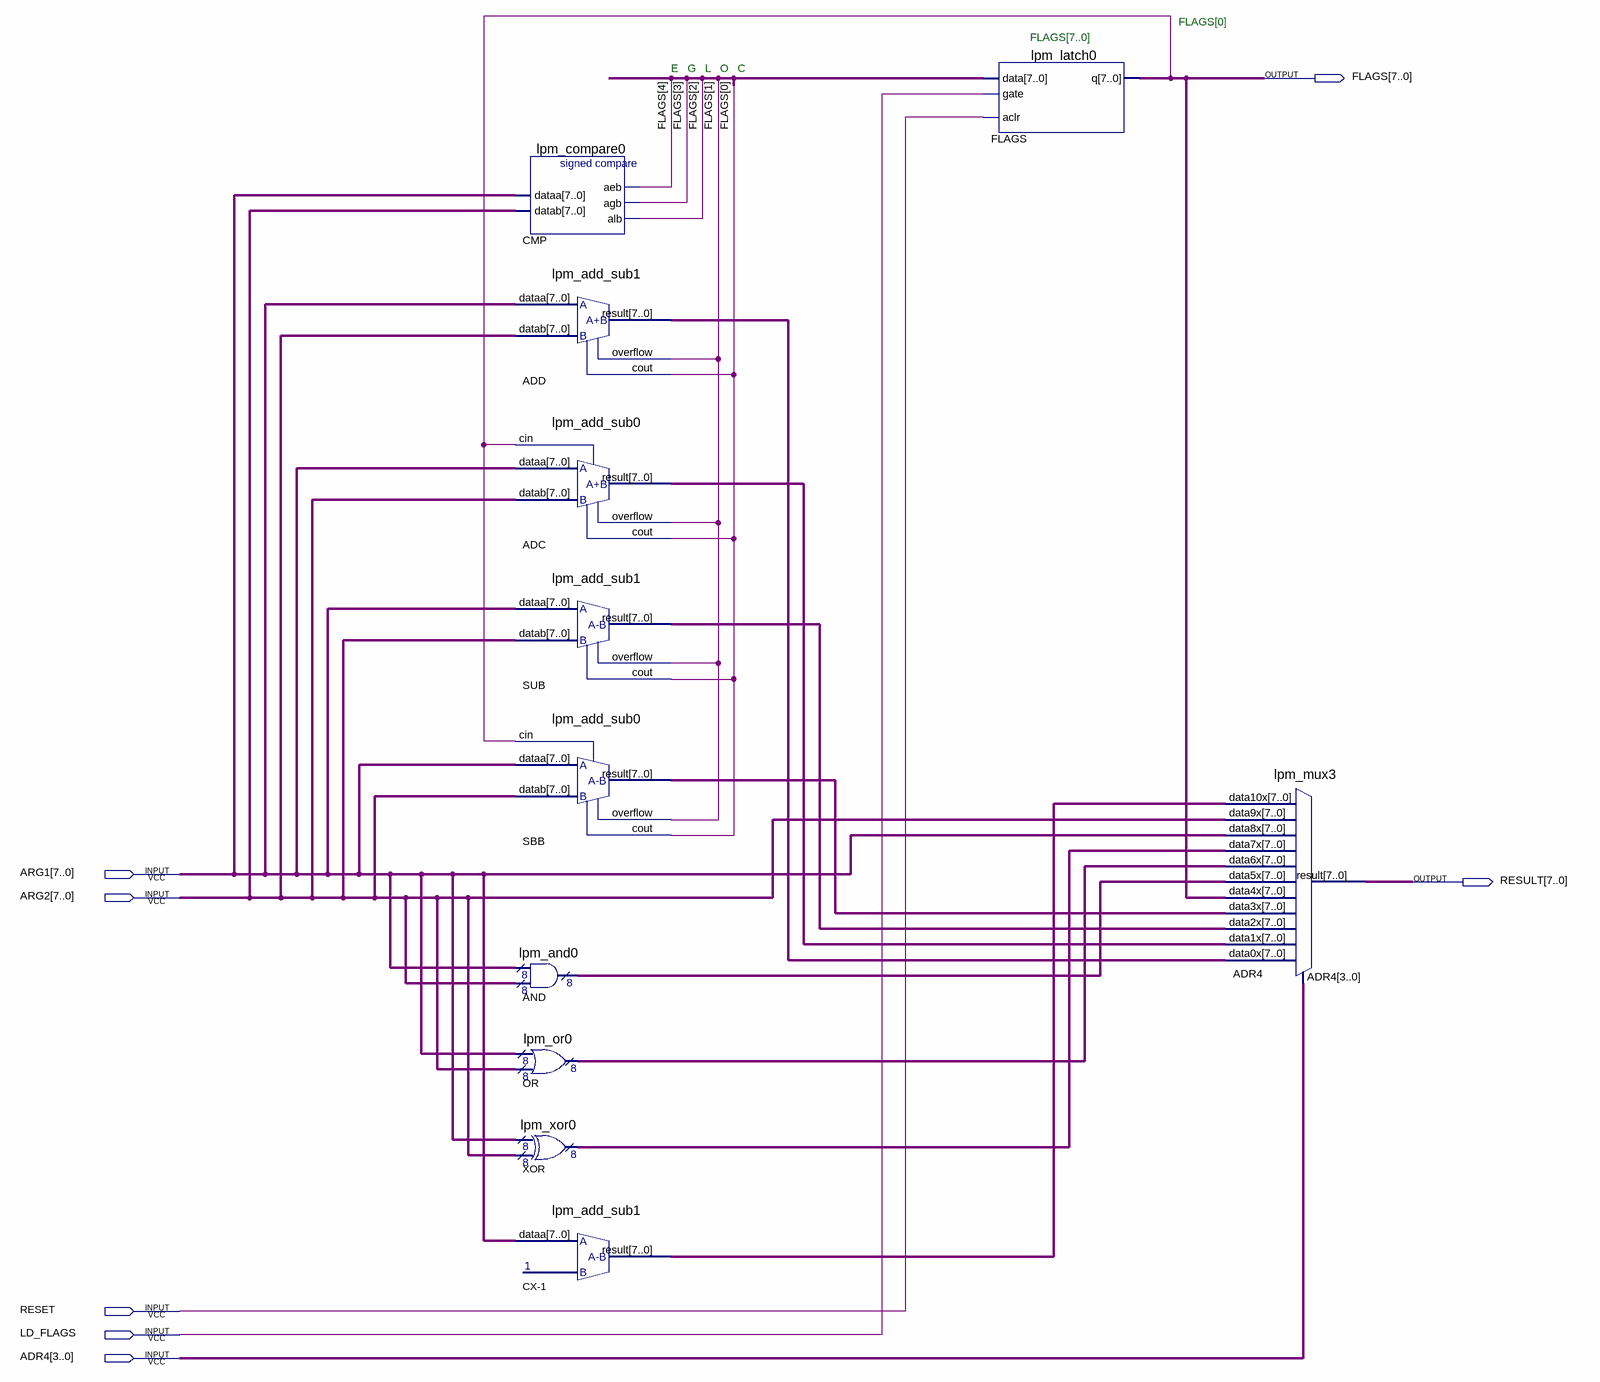
[diagram p0: schematic sheet]
// Quartus schematic ALU.bdf as structural Verilog: 11 symbols, 7 pins
module ALU (
  input  [7:0] ARG1,
  input  [7:0] ARG2,
  input  RESET,
  input  LD_FLAGS,
  input  [3:0] ADR4,
  output [7:0] FLAGS,
  output [7:0] RESULT
);

  wire undriven;
  wire [7:0] ADC_result, ADD_result, AND_result, CX_1_result, OR_result, SBB_result, SUB_result, undriven_2,
       XOR_result;

  lpm_compare0 CMP (.dataa(ARG1), .datab(ARG2), .aeb(FLAGS[4]), .agb(FLAGS[3]), .alb(FLAGS[2]));
  lpm_add_sub1 ADD (.dataa(ARG1), .datab(ARG2), .result(ADD_result), .overflow(FLAGS[1]), .cout(FLAGS[0]));
  lpm_add_sub0 ADC (
    .dataa(ARG1), .datab(ARG2), .cin(undriven), .result(ADC_result), .overflow(FLAGS[1]), .cout(FLAGS[0]));
  lpm_add_sub1 SUB (.dataa(ARG1), .datab(ARG2), .result(SUB_result), .overflow(FLAGS[1]), .cout(FLAGS[0]));
  lpm_add_sub0 SBB (
    .dataa(ARG1), .datab(ARG2), .cin(undriven), .result(SBB_result), .overflow(FLAGS[1]), .cout(FLAGS[0]));
  lpm_and0 AND (.data0x(ARG1), .data1x(ARG2), .result(AND_result));
  lpm_or0 OR (.data0x(ARG1), .data1x(ARG2), .result(OR_result));
  lpm_xor0 XOR (.data0x(ARG1), .data1x(ARG2), .result(XOR_result));
  lpm_add_sub1 \CX-1  (.dataa(ARG1), .result(CX_1_result));
  lpm_latch0 u_FLAGS (.data(undriven_2), .gate(LD_FLAGS), .aclr(RESET), .q(FLAGS));
  lpm_mux3 u_ADR4 (
    .data10x(CX_1_result), .data9x(ARG2), .data8x(ARG1), .data7x(XOR_result), .data6x(OR_result),
    .data5x(AND_result), .data4x(FLAGS), .data3x(SBB_result), .data2x(SUB_result), .data1x(ADC_result),
    .data0x(ADD_result), .ADR4(ADR4), .result(RESULT));

  // Notes on the sheet:
  //   FLAGS[0]
  //   FLAGS[7..0]
  //   E   G   L   O   C
endmodule
